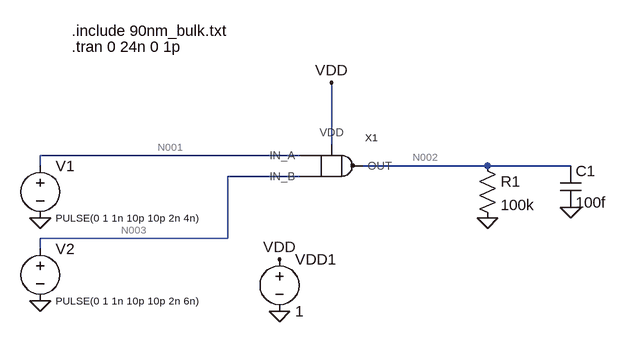
[diagram p0: schematic nand_test.asc]
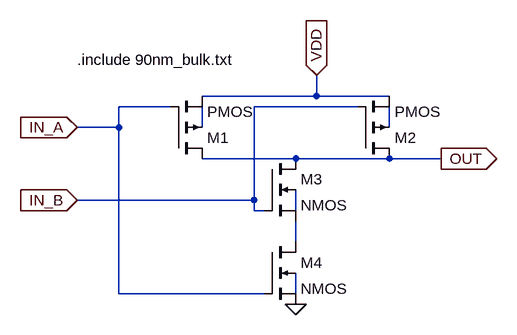
[diagram p1: sub-circuit nand.asc]
nand_test.asc, the LTspice schematic file:
Version 4
SHEET 1 880 680
WIRE 192 112 192 16
WIRE 144 128 -256 128
WIRE -256 144 -256 128
WIRE 432 144 240 144
WIRE 560 144 432 144
WIRE 144 160 32 160
WIRE 32 256 32 160
WIRE 32 256 -256 256
WIRE -256 272 -256 256
FLAG 112 368 0
FLAG 112 288 VDD
FLAG 192 16 VDD
FLAG -256 224 0
FLAG -256 352 0
FLAG 432 224 0
FLAG 560 208 0
SYMBOL nand 192 144 R0
SYMATTR InstName X1
SYMBOL voltage 112 272 R0
WINDOW 123 0 0 Left 0
WINDOW 39 0 0 Left 0
SYMATTR InstName VDD1
SYMATTR Value 1
SYMBOL voltage -256 128 R0
WINDOW 3 24 96 Left 1
WINDOW 123 0 0 Left 0
WINDOW 39 0 0 Left 0
SYMATTR InstName V1
SYMATTR Value PULSE(0 1 1n 10p 10p 2n 4n)
SYMBOL voltage -256 256 R0
WINDOW 3 24 96 Left 1
WINDOW 123 0 0 Left 0
WINDOW 39 0 0 Left 0
SYMATTR InstName V2
SYMATTR Value PULSE(0 1 1n 10p 10p 2n 6n)
SYMBOL res 416 128 R0
SYMATTR InstName R1
SYMATTR Value 100k
SYMBOL cap 544 144 R0
SYMATTR InstName C1
SYMATTR Value 100f
TEXT -208 -64 Left 2 !.include 90nm_bulk.txt
TEXT -208 -40 Left 2 !.tran 0 24n 0 1p

nand.asc, the sub-circuit schematic file:
Version 4
SHEET 1 880 680
WIRE 256 64 256 32
WIRE 256 64 80 64
WIRE 368 64 256 64
WIRE 32 80 -48 80
WIRE 320 80 160 80
WIRE -48 112 -48 80
WIRE -48 112 -112 112
WIRE 80 112 80 80
WIRE 368 112 368 80
WIRE 224 160 80 160
WIRE 368 160 224 160
WIRE 448 160 368 160
WIRE 160 224 160 80
WIRE 160 224 -112 224
WIRE 160 240 160 224
WIRE 176 240 160 240
WIRE 224 240 224 208
WIRE 224 288 224 256
WIRE -48 368 -48 112
WIRE 176 368 -48 368
WIRE 224 368 224 336
FLAG -112 112 IN_A
IOPIN -112 112 In
FLAG 224 384 0
FLAG 256 32 VDD
IOPIN 256 32 In
FLAG -112 224 IN_B
IOPIN -112 224 In
FLAG 448 160 OUT
IOPIN 448 160 Out
SYMBOL pmos4 32 160 M180
SYMATTR InstName M1
SYMATTR Value2 l=90n w=400n
SYMBOL pmos4 320 160 M180
SYMATTR InstName M2
SYMATTR Value2 l=90n w=400n
SYMBOL nmos4 176 160 R0
SYMATTR InstName M3
SYMATTR Value2 l=90n w=200n
SYMBOL nmos4 176 288 R0
SYMATTR InstName M4
SYMATTR Value2 l=90n w=200n
TEXT -112 8 Left 2 !.include 90nm_bulk.txt

The netlist it stands for:
* nand_test.asc
XX1 N001 N003 VDD N002 nand
VDD1 VDD 0 1
V1 N001 0 PULSE(0 1 1n 10p 10p 2n 4n)
V2 N003 0 PULSE(0 1 1n 10p 10p 2n 6n)
R1 N002 0 100k
C1 N002 0 100f

* block symbol definitions
.subckt nand IN_A IN_B VDD OUT
M1 OUT IN_A VDD N001 PMOS l=90n w=400n
M2 OUT IN_B VDD N002 PMOS l=90n w=400n
M3 OUT IN_B N004 N003 NMOS l=90n w=200n
M4 N004 IN_A 0 N005 NMOS l=90n w=200n
.include 90nm_bulk.txt
.ends nand

.model NMOS NMOS
.model PMOS PMOS
.lib standard.mos
.include 90nm_bulk.txt
.tran 0 24n 0 1p
.backanno
.end

* Results of the author's LTspice run, read from the files saved beside the schematic
* Operating Point, zero values left out:
*   V(n002) = 986.9 mV
*   V(vdd) = 1 V
*   I(R1) = 9.869 µA
*   I(Vdd1) = -9.869 µA
*   I(V1) = 2.876 pA
*   I(V2) = 120.7 pA
*   Ix(x1:IN_A) = -2.876 pA
*   Ix(x1:IN_B) = -120.7 pA
*   Ix(x1:VDD) = 9.869 µA
*   Ix(x1:OUT) = -9.869 µA
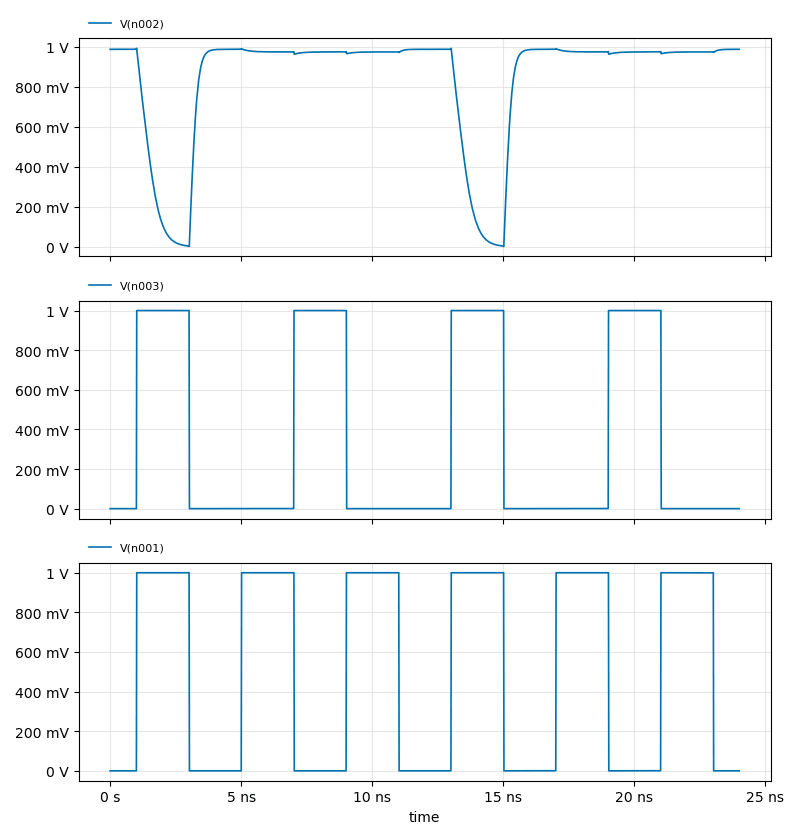
[diagram p2: Transient Analysis of nand_test.asc, plotted from the saved traces]
* Transient Analysis, 1 run:
*   V(n002): min 2.001 mV, max 991.6 mV, average 840.1 mV, rms 893.7 mV, last 986.8 mV
*   V(n003): min 0 V, max 1 V, average 335 mV, rms 578.3 mV, last 0 V
*   V(n001): min 0 V, max 1 V, average 502.5 mV, rms 708.3 mV, last 0 V